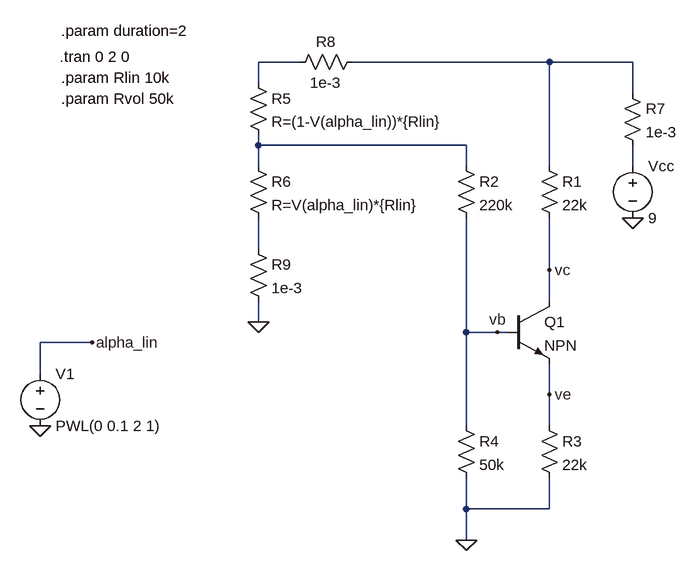
[diagram p0: schematic Draft1.asc]
Draft1.asc, the LTspice schematic file:
Version 4
SHEET 1 880 680
WIRE -128 -272 -192 -272
WIRE 256 -272 -48 -272
WIRE 384 -272 256 -272
WIRE -192 -240 -192 -272
WIRE 384 -224 384 -272
WIRE -192 -144 -192 -160
WIRE 128 -144 -192 -144
WIRE -192 -112 -192 -144
WIRE 128 -112 128 -144
WIRE 256 -112 256 -272
WIRE 384 -112 384 -144
WIRE -192 16 -192 -32
WIRE 256 48 256 -32
WIRE 256 96 256 48
WIRE -192 128 -192 96
WIRE 128 144 128 -32
WIRE 176 144 128 144
WIRE 192 144 176 144
WIRE -448 160 -528 160
WIRE -528 208 -528 160
WIRE 256 240 256 192
WIRE 128 288 128 144
WIRE 256 288 256 240
WIRE 128 416 128 368
WIRE 256 416 256 368
WIRE 256 416 128 416
WIRE 128 464 128 416
FLAG 384 -32 0
FLAG 128 464 0
FLAG 176 144 vb
FLAG 256 48 vc
FLAG 256 240 ve
FLAG -528 288 0
FLAG -448 160 alpha_lin
FLAG -192 128 0
SYMBOL res 240 -128 R0
SYMATTR InstName R1
SYMATTR Value 22k
SYMBOL res 112 -128 R0
SYMATTR InstName R2
SYMATTR Value 220k
SYMBOL voltage 384 -128 R0
WINDOW 123 0 0 Left 0
WINDOW 39 0 0 Left 0
SYMATTR InstName Vcc
SYMATTR Value 9
SYMBOL res 240 272 R0
SYMATTR InstName R3
SYMATTR Value 22k
SYMBOL res 112 272 R0
SYMATTR InstName R4
SYMATTR Value 50k
SYMBOL res -208 -256 R0
SYMATTR InstName R5
SYMATTR Value R=(1-V(alpha_lin))*{Rlin}
SYMBOL res -208 -128 R0
SYMATTR InstName R6
SYMATTR Value R=V(alpha_lin)*{Rlin}
SYMBOL res 368 -240 R0
SYMATTR InstName R7
SYMATTR Value 1e-3
SYMBOL npn 192 96 R0
SYMATTR InstName Q1
SYMBOL voltage -528 192 R0
WINDOW 123 0 0 Left 0
WINDOW 39 0 0 Left 0
SYMATTR InstName V1
SYMATTR Value PWL(0 0.1 2 1)
SYMBOL res -32 -288 R90
WINDOW 0 0 56 VBottom 2
WINDOW 3 32 56 VTop 2
SYMATTR InstName R8
SYMATTR Value 1e-3
SYMBOL res -208 0 R0
SYMATTR InstName R9
SYMATTR Value 1e-3
TEXT -496 -248 Left 2 !.param Rlin 10k
TEXT -496 -216 Left 2 !.param Rvol 50k
TEXT -496 -320 Left 2 !.param duration=2
TEXT -498 -280 Left 2 !.tran 0 2 0

The netlist it stands for:
* Draft1.asc
R1 N002 vc 22k
R2 N003 vb 220k
Vcc N004 0 9
R3 ve 0 22k
R4 vb 0 50k
R5 N001 N003 R=(1-V(alpha_lin))*{Rlin}
R6 N003 N005 R=V(alpha_lin)*{Rlin}
R7 N002 N004 1e-3
Q1 vc vb ve 0 NPN
V1 alpha_lin 0 PWL(0 0.1 2 1)
R8 N002 N001 1e-3
R9 N005 0 1e-3
.model NPN NPN
.model PNP PNP
.lib standard.bjt
.param Rlin 10k
.param Rvol 50k
.param duration=2
.tran 0 2 0
.backanno
.end